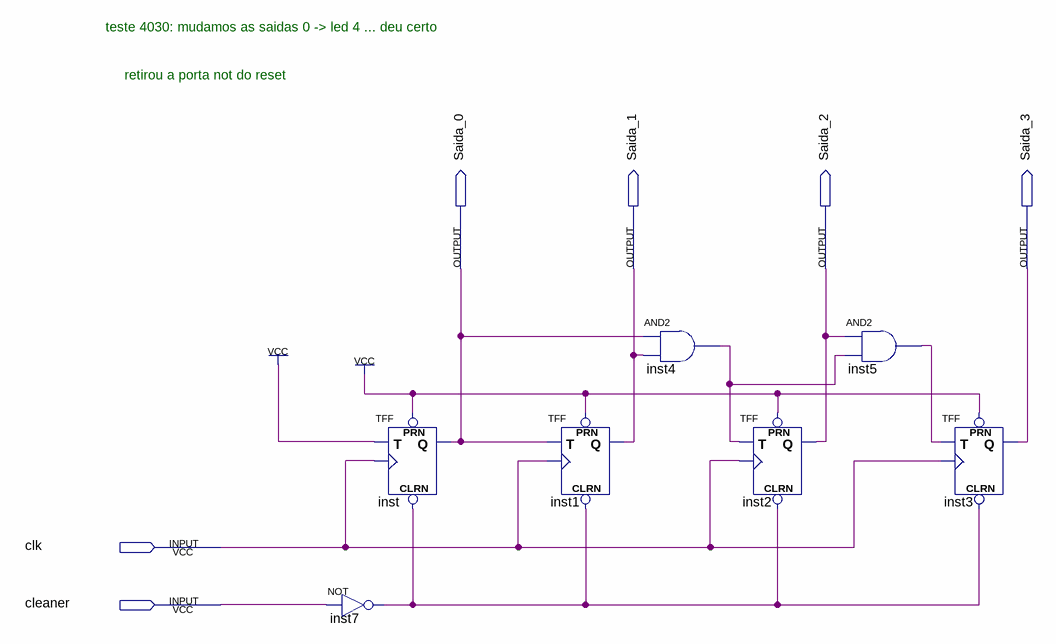
[diagram p0: schematic sheet]
// Quartus schematic Contador_de_4_Bits.bdf as structural Verilog: 7 symbols, 6 pins
module Contador_de_4_Bits (
  input  clk,
  input  cleaner,
  output Saida_0,
  output Saida_1,
  output Saida_2,
  output Saida_3
);

  wire inst4_out, inst5_out, inst7_out;

  TFF inst (.PRN(1'b1), .CLRN(inst7_out), .T(1'b1), .CLK(clk), .Q(Saida_0));
  not inst7 (inst7_out, cleaner);
  TFF inst1 (.PRN(1'b1), .CLRN(inst7_out), .T(Saida_0), .CLK(clk), .Q(Saida_1));
  and inst4 (inst4_out, Saida_0, Saida_1);
  TFF inst2 (.PRN(1'b1), .CLRN(inst7_out), .T(inst4_out), .CLK(clk), .Q(Saida_2));
  and inst5 (inst5_out, Saida_2, inst4_out);
  TFF inst3 (.PRN(1'b1), .CLRN(inst7_out), .T(inst5_out), .CLK(clk), .Q(Saida_3));

  // Notes on the sheet:
  //   teste 4030: mudamos as saidas 0 -> led 4 ... deu certo
  //   retirou a porta not do reset
endmodule
